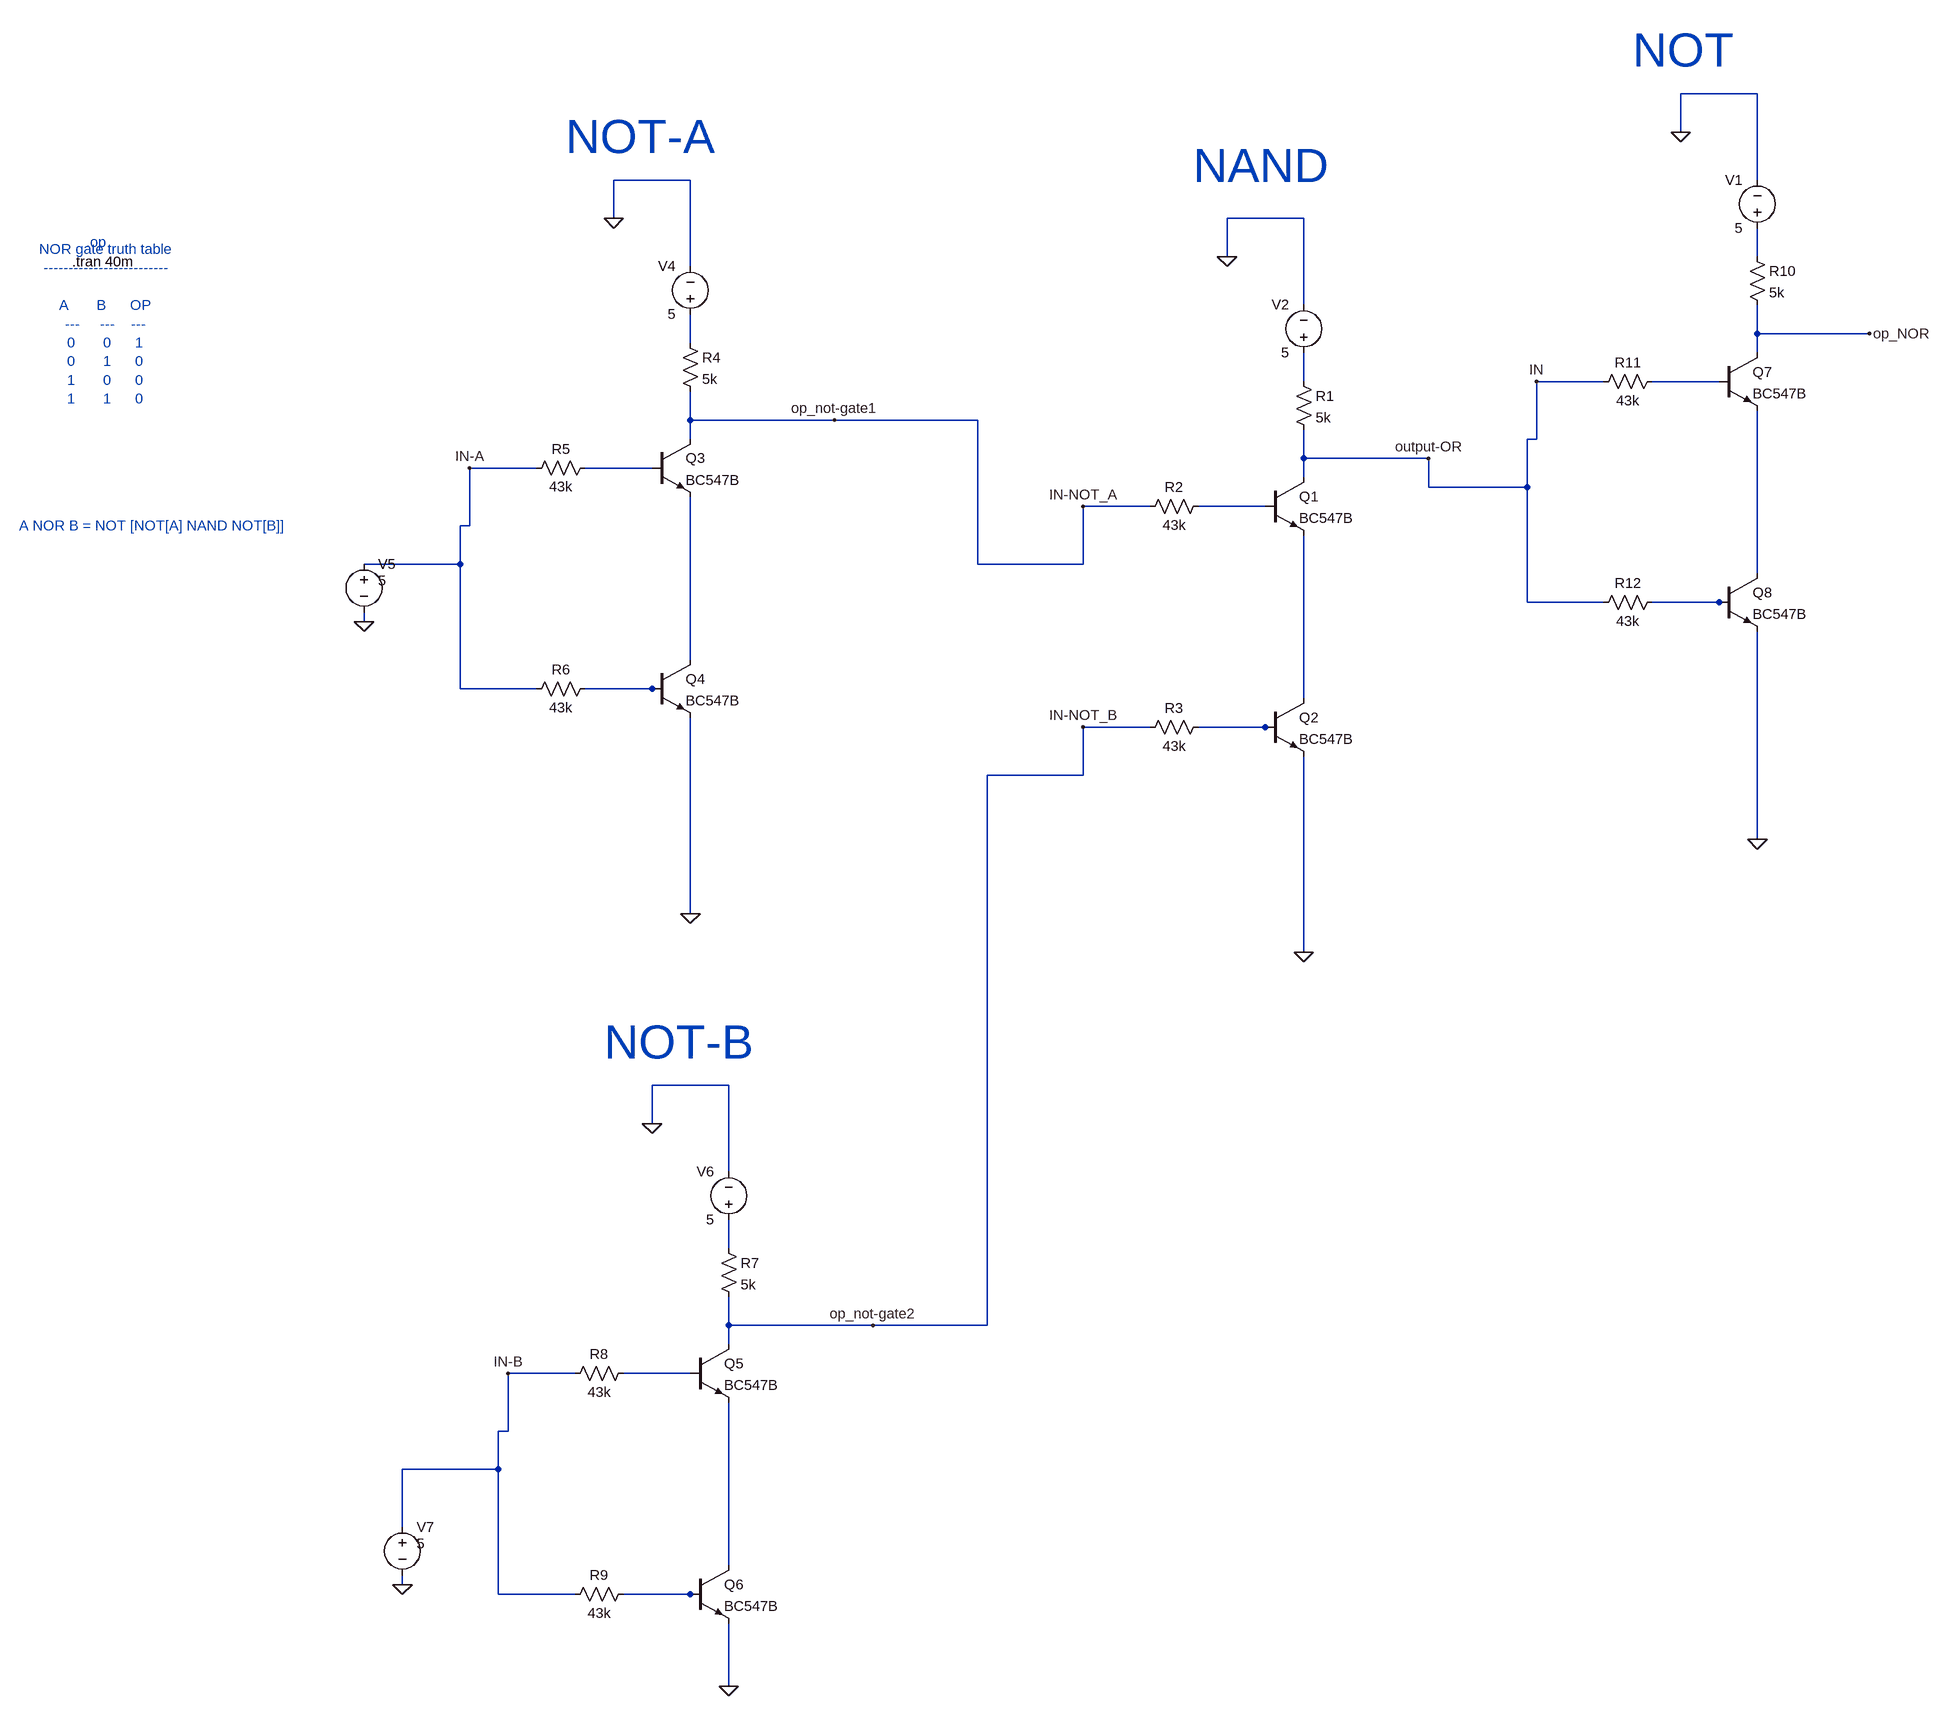
[diagram p0: schematic NOR_gate_using_NAND_gate.asc]
NOR_gate_using_NAND_gate.asc, the LTspice schematic file:
Version 4.1
SHEET 1 4048 2404
WIRE 3632 -592 3504 -592
WIRE 3504 -528 3504 -592
WIRE 512 -448 384 -448
WIRE 3632 -448 3632 -592
WIRE 384 -384 384 -448
WIRE 2576 -384 2448 -384
WIRE 2448 -320 2448 -384
WIRE 3632 -320 3632 -368
WIRE 512 -304 512 -448
WIRE 2576 -240 2576 -384
WIRE 3632 -192 3632 -240
WIRE 3872 -192 3632 -192
WIRE 512 -176 512 -224
WIRE 3632 -160 3632 -192
WIRE 2576 -112 2576 -160
WIRE 3376 -112 3264 -112
WIRE 3568 -112 3456 -112
WIRE 512 -48 512 -96
WIRE 752 -48 512 -48
WIRE 1696 -48 752 -48
WIRE 512 -16 512 -48
WIRE 3264 -16 3264 -112
WIRE 3264 -16 3248 -16
WIRE 2576 16 2576 -32
WIRE 2784 16 2576 16
WIRE 256 32 144 32
WIRE 448 32 336 32
WIRE 2576 48 2576 16
WIRE 2784 64 2784 16
WIRE 3248 64 3248 -16
WIRE 3248 64 2784 64
WIRE 2320 96 2208 96
WIRE 2512 96 2400 96
WIRE 144 128 144 32
WIRE 144 128 128 128
WIRE 128 192 128 128
WIRE 128 192 -32 192
WIRE 1696 192 1696 -48
WIRE 2208 192 2208 96
WIRE 2208 192 1696 192
WIRE 3632 208 3632 -64
WIRE 3248 256 3248 64
WIRE 3376 256 3248 256
WIRE 3568 256 3456 256
WIRE 3584 256 3568 256
WIRE -32 288 -32 272
WIRE 512 352 512 80
WIRE 128 400 128 192
WIRE 256 400 128 400
WIRE 448 400 336 400
WIRE 464 400 448 400
WIRE 2576 416 2576 144
WIRE 2320 464 2208 464
WIRE 2512 464 2400 464
WIRE 2528 464 2512 464
WIRE 2208 544 2208 464
WIRE 2208 544 1712 544
WIRE 3632 656 3632 304
WIRE 512 800 512 448
WIRE 2576 864 2576 512
WIRE 576 1136 448 1136
WIRE 448 1200 448 1136
WIRE 576 1280 576 1136
WIRE 576 1408 576 1360
WIRE 576 1536 576 1488
WIRE 816 1536 576 1536
WIRE 1712 1536 1712 544
WIRE 1712 1536 816 1536
WIRE 576 1568 576 1536
WIRE 320 1616 208 1616
WIRE 512 1616 400 1616
WIRE 208 1712 208 1616
WIRE 208 1712 192 1712
WIRE 192 1776 192 1712
WIRE 192 1776 32 1776
WIRE 32 1872 32 1776
WIRE 576 1936 576 1664
WIRE 32 1968 32 1952
WIRE 192 1984 192 1776
WIRE 320 1984 192 1984
WIRE 512 1984 400 1984
WIRE 528 1984 512 1984
WIRE 576 2384 576 2032
FLAG 2208 96 IN-NOT_A
FLAG 2448 -320 0
FLAG 2784 16 output-OR
FLAG 2576 864 0
FLAG 2208 464 IN-NOT_B
FLAG 144 32 IN-A
FLAG 384 -384 0
FLAG 752 -48 op_not-gate1
FLAG 512 800 0
FLAG -32 288 0
FLAG 208 1616 IN-B
FLAG 448 1200 0
FLAG 816 1536 op_not-gate2
FLAG 576 2384 0
FLAG 32 1968 0
FLAG 3264 -112 IN
FLAG 3504 -528 0
FLAG 3872 -192 op_NOR
FLAG 3632 656 0
SYMBOL npn 2512 48 R0
SYMATTR InstName Q1
SYMATTR Value BC547B
SYMBOL voltage 2576 -144 R180
WINDOW 0 24 96 Left 2
WINDOW 3 24 16 Left 2
WINDOW 123 0 0 Left 0
WINDOW 39 0 0 Left 0
SYMATTR InstName V2
SYMATTR Value 5
SYMBOL res 2560 -128 R0
SYMATTR InstName R1
SYMATTR Value 5k
SYMBOL res 2416 80 R90
WINDOW 0 0 56 VBottom 2
WINDOW 3 32 56 VTop 2
SYMATTR InstName R2
SYMATTR Value 43k
SYMBOL npn 2512 416 R0
SYMATTR InstName Q2
SYMATTR Value BC547B
SYMBOL res 2416 448 R90
WINDOW 0 0 56 VBottom 2
WINDOW 3 32 56 VTop 2
SYMATTR InstName R3
SYMATTR Value 43k
SYMBOL npn 448 -16 R0
SYMATTR InstName Q3
SYMATTR Value BC547B
SYMBOL voltage 512 -208 R180
WINDOW 0 24 96 Left 2
WINDOW 3 24 16 Left 2
WINDOW 123 0 0 Left 0
WINDOW 39 0 0 Left 0
SYMATTR InstName V4
SYMATTR Value 5
SYMBOL res 496 -192 R0
SYMATTR InstName R4
SYMATTR Value 5k
SYMBOL res 352 16 R90
WINDOW 0 0 56 VBottom 2
WINDOW 3 32 56 VTop 2
SYMATTR InstName R5
SYMATTR Value 43k
SYMBOL npn 448 352 R0
SYMATTR InstName Q4
SYMATTR Value BC547B
SYMBOL res 352 384 R90
WINDOW 0 0 56 VBottom 2
WINDOW 3 32 56 VTop 2
SYMATTR InstName R6
SYMATTR Value 43k
SYMBOL voltage -32 176 R0
WINDOW 3 24 44 Left 2
WINDOW 123 0 0 Left 0
WINDOW 39 0 0 Left 0
SYMATTR Value 5
SYMATTR InstName V5
SYMBOL npn 512 1568 R0
SYMATTR InstName Q5
SYMATTR Value BC547B
SYMBOL voltage 576 1376 R180
WINDOW 0 24 96 Left 2
WINDOW 3 24 16 Left 2
WINDOW 123 0 0 Left 0
WINDOW 39 0 0 Left 0
SYMATTR InstName V6
SYMATTR Value 5
SYMBOL res 560 1392 R0
SYMATTR InstName R7
SYMATTR Value 5k
SYMBOL res 416 1600 R90
WINDOW 0 0 56 VBottom 2
WINDOW 3 32 56 VTop 2
SYMATTR InstName R8
SYMATTR Value 43k
SYMBOL npn 512 1936 R0
SYMATTR InstName Q6
SYMATTR Value BC547B
SYMBOL res 416 1968 R90
WINDOW 0 0 56 VBottom 2
WINDOW 3 32 56 VTop 2
SYMATTR InstName R9
SYMATTR Value 43k
SYMBOL voltage 32 1856 R0
WINDOW 3 24 44 Left 2
WINDOW 123 0 0 Left 0
WINDOW 39 0 0 Left 0
SYMATTR Value 5
SYMATTR InstName V7
SYMBOL npn 3568 -160 R0
SYMATTR InstName Q7
SYMATTR Value BC547B
SYMBOL voltage 3632 -352 R180
WINDOW 0 24 96 Left 2
WINDOW 3 24 16 Left 2
WINDOW 123 0 0 Left 0
WINDOW 39 0 0 Left 0
SYMATTR InstName V1
SYMATTR Value 5
SYMBOL res 3616 -336 R0
SYMATTR InstName R10
SYMATTR Value 5k
SYMBOL res 3472 -128 R90
WINDOW 0 0 56 VBottom 2
WINDOW 3 32 56 VTop 2
SYMATTR InstName R11
SYMATTR Value 43k
SYMBOL npn 3568 208 R0
SYMATTR InstName Q8
SYMATTR Value BC547B
SYMBOL res 3472 240 R90
WINDOW 0 0 56 VBottom 2
WINDOW 3 32 56 VTop 2
SYMATTR InstName R12
SYMATTR Value 43k
TEXT -712 -312 Left 2 !.tran 40m
TEXT -688 -344 Left 2 ;.op
TEXT -656 -208 Center 2 ;NOR gate truth table\n-------------------------\n \nA       B      OP\n---     ---    ---\n0       0      1\n0       1      0\n1       0      0\n1       1      0
TEXT -800 128 Left 2 ;A NOR B = NOT [NOT[A] NAND NOT[B]]
TEXT 2392 -472 Left 6 ;NAND
TEXT 304 -520 Left 6 ;NOT-A
TEXT 368 1064 Left 6 ;NOT-B
TEXT 3424 -664 Left 6 ;NOT

The netlist it stands for:
* NOR_gate_using_NAND_gate.asc
Q1 IN N006 N011 0 BC547B
V2 N003 0 5
R1 N003 IN 5k
R2 N006 op_not-gate1 43k
Q2 N011 N012 0 0 BC547B
R3 N012 op_not-gate2 43k
Q3 op_not-gate1 N005 N009 0 BC547B
V4 N002 0 5
R4 N002 op_not-gate1 5k
R5 N005 IN-A 43k
Q4 N009 N010 0 0 BC547B
R6 N010 IN-A 43k
V5 IN-A 0 5
Q5 op_not-gate2 N014 N015 0 BC547B
V6 N013 0 5
R7 N013 op_not-gate2 5k
R8 N014 IN-B 43k
Q6 N015 N016 0 0 BC547B
R9 N016 IN-B 43k
V7 IN-B 0 5
Q7 op_NOR N004 N007 0 BC547B
V1 N001 0 5
R10 N001 op_NOR 5k
R11 N004 IN 43k
Q8 N007 N008 0 0 BC547B
R12 N008 IN 43k
.model NPN NPN
.model PNP PNP
.lib standard.bjt
.tran 40m
* .op
* NOR gate truth table
* -------------------------
* A       B      OP
* ---     ---    ---
* 0       0      1
* 0       1      0
* 1       0      0
* 1       1      0
* A NOR B = NOT [NOT[A] NAND NOT[B]]
* NAND
* NOT-A
* NOT-B
* NOT
.backanno
.end